# Altium schematic sheet breakout.schDoc: CJ125 Breakout
size A4; SheetNumber: 1; SheetTotal: 1
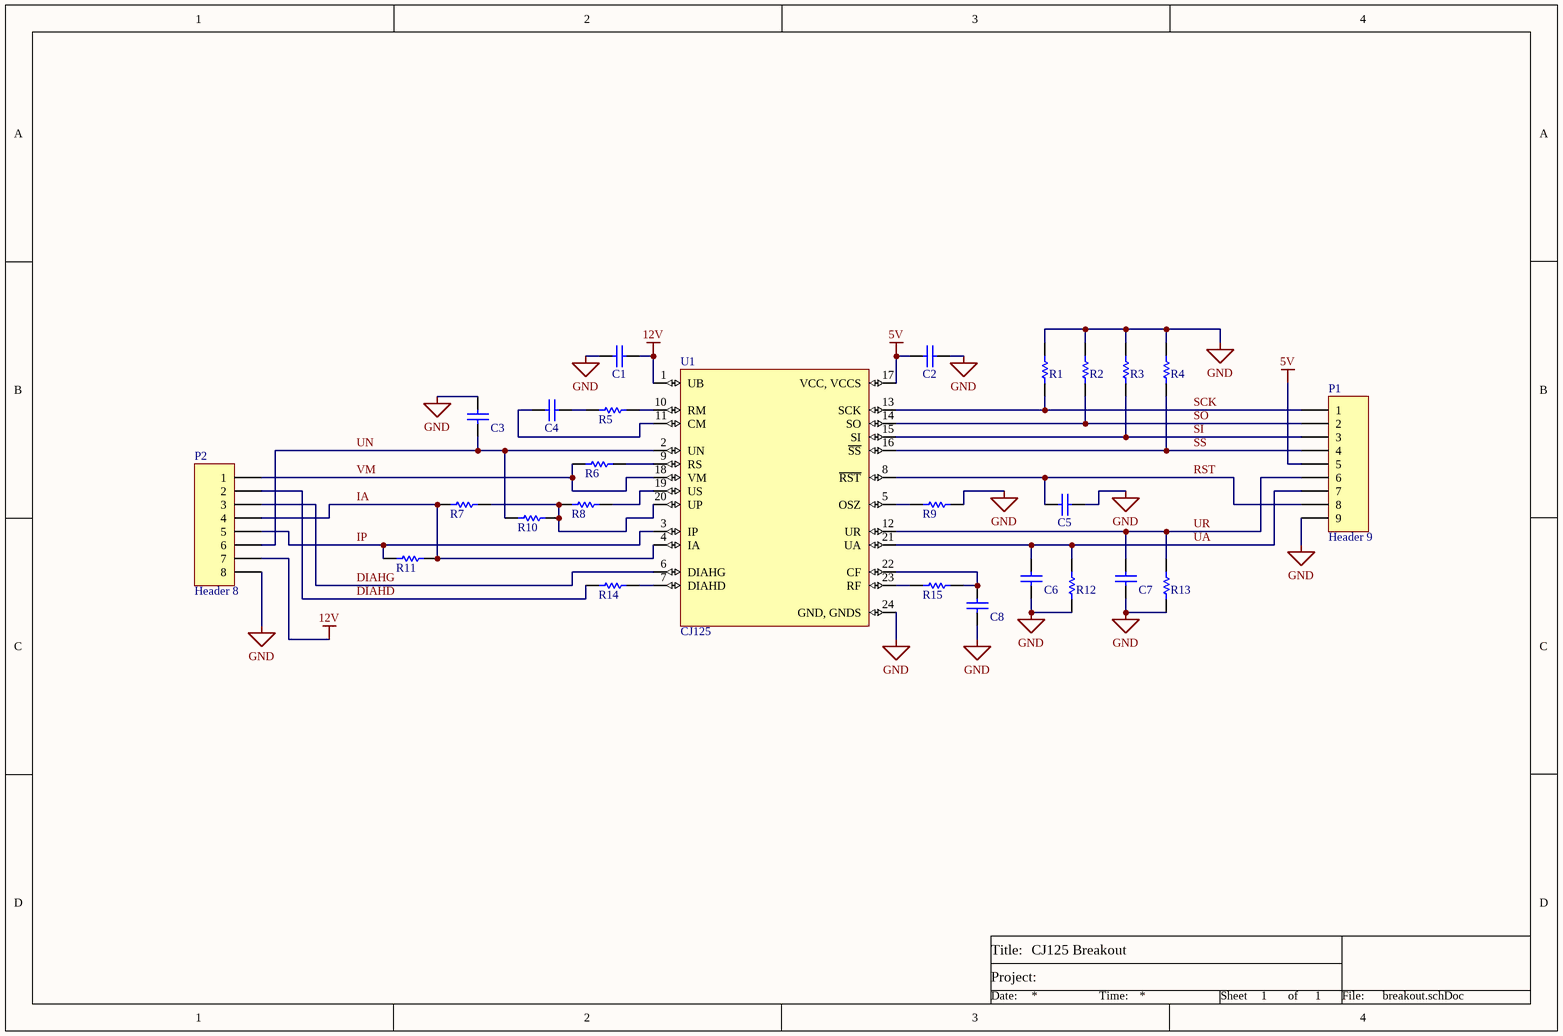
[diagram p0: breakout.schDoc]

## Parts
C1  Generic 0805 Capacitor  [0805]  (value not drawn)
C2  Generic 0805 Capacitor  [0805]  (value not drawn)
C3  Generic 0805 Capacitor  [0805]  (value not drawn)
C4  Generic 0805 Capacitor  [0805]  (value not drawn)
C5  Generic 0805 Capacitor  [0805]  (value not drawn)
C6  Generic 0805 Capacitor  [0805]  (value not drawn)
C7  Generic 0805 Capacitor  [0805]  (value not drawn)
C8  Generic 0805 Capacitor  [0805]  (value not drawn)
P1  Header 9  [HDR1X9]
P2  Header 8  [HDR1X8]
R1  Generic 0603 Resistor  [0603]  (value not drawn)
R2  Generic 0603 Resistor  [0603]  (value not drawn)
R3  Generic 0603 Resistor  [0603]  (value not drawn)
R4  Generic 0603 Resistor  [0603]  (value not drawn)
R5  Generic 0603 Resistor  [0603]  (value not drawn)
R6  Generic 0603 Resistor  [0603]  (value not drawn)
R7  Generic 0603 Resistor  [0603]  (value not drawn)
R8  Generic 0603 Resistor  [0603]  (value not drawn)
R9  Generic 0603 Resistor  [0603]  (value not drawn)
R10  Generic 0603 Resistor  [0603]  (value not drawn)
R11  Generic 0603 Resistor  [0603]  (value not drawn)
R12  Generic 0603 Resistor  [0603]  (value not drawn)
R13  Generic 0603 Resistor  [0603]  (value not drawn)
R14  Generic 0603 Resistor  [0603]  (value not drawn)
R15  Generic 0603 Resistor  [0603]  (value not drawn)
U1  CJ125  [SOIC-24]

## Nets
5V: C2.1 P1.5 U1.17(VCC,_VCCS)
12V: C1.2 P2.7 U1.1(UB)
GND: C1.1 C2.2 C3.2 C5.2 C6.1 C7.1 C8.1 P1.9 P2.8 R1.2 R2.2 R3.2 R4.2 R9.2 R12.1 R13.1 U1.24(GND,_GNDS)
DIAHD: P2.2 R14.1
DIAHG: P2.3 U1.6(DIAHG)
IA: P2.4 R7.1 R11.2 U1.4(IA)
IP: P2.5 R11.1 U1.3(IP)
RST: C5.1 P1.8 U1.8(~{RST})
SCK: P1.1 R1.1 U1.13(SCK)
SI: P1.3 R3.1 U1.15(SI)
SO: P1.2 R2.1 U1.14(SO)
SS: P1.4 R4.1 U1.16(~{SS})
UA: C6.2 P1.7 R12.2 U1.21(UA)
UN: C3.1 P2.6 R10.1 U1.2(UN)
UR: C7.2 P1.6 R13.2 U1.12(UR)
VM: P2.1 R6.1 U1.18(VM)
NetC4_1: C4.1 U1.11(CM)
NetC4_2: C4.2 R5.1
NetC8_2: C8.2 R15.2 U1.22(CF)
NetR5_2: R5.2 U1.10(RM)
NetR6_2: R6.2 U1.9(RS)
NetR7_2: R7.2 R8.1 R10.2 U1.20(UP)
NetR8_2: R8.2 U1.19(US)
NetR9_1: R9.1 U1.5(OSZ)
NetR14_2: R14.2 U1.7(DIAHD)
NetR15_1: R15.1 U1.23(RF)

## Notes on the sheet
- Title:
- Project:
- Date:
- Time:
- Sheet
- of
- File:
- Title
- Size:
- E
- Number:
- Revision:

## Library data of the parts
C1-C8 = C_0805: Value: *; Specifications: *
P1 = Header 9: Header, 9-Pin; LatestRevisionDate: 17-Jul-2002; LatestRevisionNote: Re-released for DXP Platform.; Publisher: Altium Limited
P2 = Header 8: Header, 8-Pin; LatestRevisionDate: 17-Jul-2002; LatestRevisionNote: Re-released for DXP Platform.; Publisher: Altium Limited
R1-R15 = R_0603: Value: *; Specifications: *
U1 = CJ125: 5V 2Mbaud SMT Lambda Probe Interface IC - SOIC-24; Supplier 1: Future Electronics; Package Reference: SOIC-24; Supplier Part Number 1: 0272240104